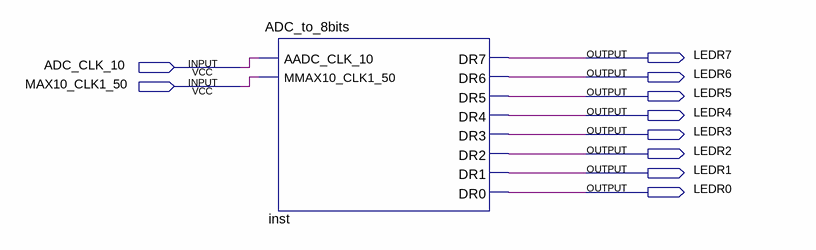
[diagram p0: schematic sheet]
// Quartus schematic hello-adc.bdf as structural Verilog: 1 symbols, 10 pins
module \hello-adc  (
  input  ADC_CLK_10,
  input  MAX10_CLK1_50,
  output LEDR7,
  output LEDR6,
  output LEDR5,
  output LEDR4,
  output LEDR3,
  output LEDR2,
  output LEDR1,
  output LEDR0
);

  ADC_to_8bits inst (
    .AADC_CLK_10(ADC_CLK_10), .MMAX10_CLK1_50(MAX10_CLK1_50), .DR7(LEDR7), .DR6(LEDR6), .DR5(LEDR5),
    .DR4(LEDR4), .DR3(LEDR3), .DR2(LEDR2), .DR1(LEDR1), .DR0(LEDR0));
endmodule
